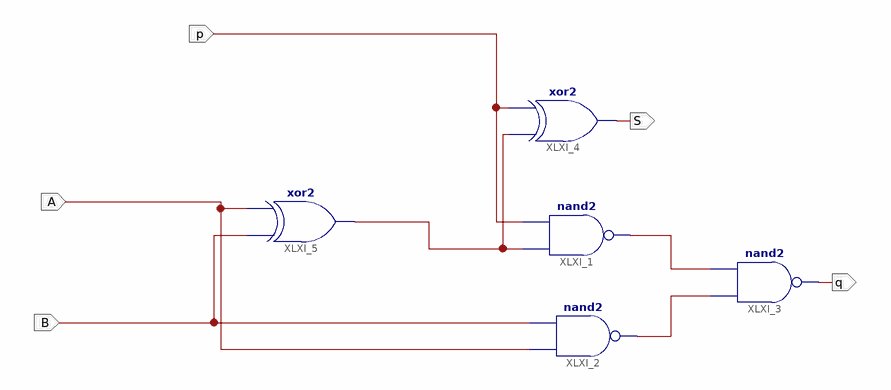
[diagram p0: schematic sheet 1]
// Xilinx ISE schematic gates.sch (spartan3e) as structural Verilog: 5 symbols, 5 ports
module gates (
  input  p,
  input  B,
  input  A,
  output q,
  output S
);

  wire XLXN_1, XLXN_2, XLXN_4;

  nand XLXI_1 (XLXN_1, XLXN_4, p);
  nand XLXI_2 (XLXN_2, A, B);
  nand XLXI_3 (q, XLXN_2, XLXN_1);
  xor XLXI_4 (S, XLXN_4, p);
  xor XLXI_5 (XLXN_4, B, A);
endmodule
